# EAGLE schematic Output (EAGLE 6.4)
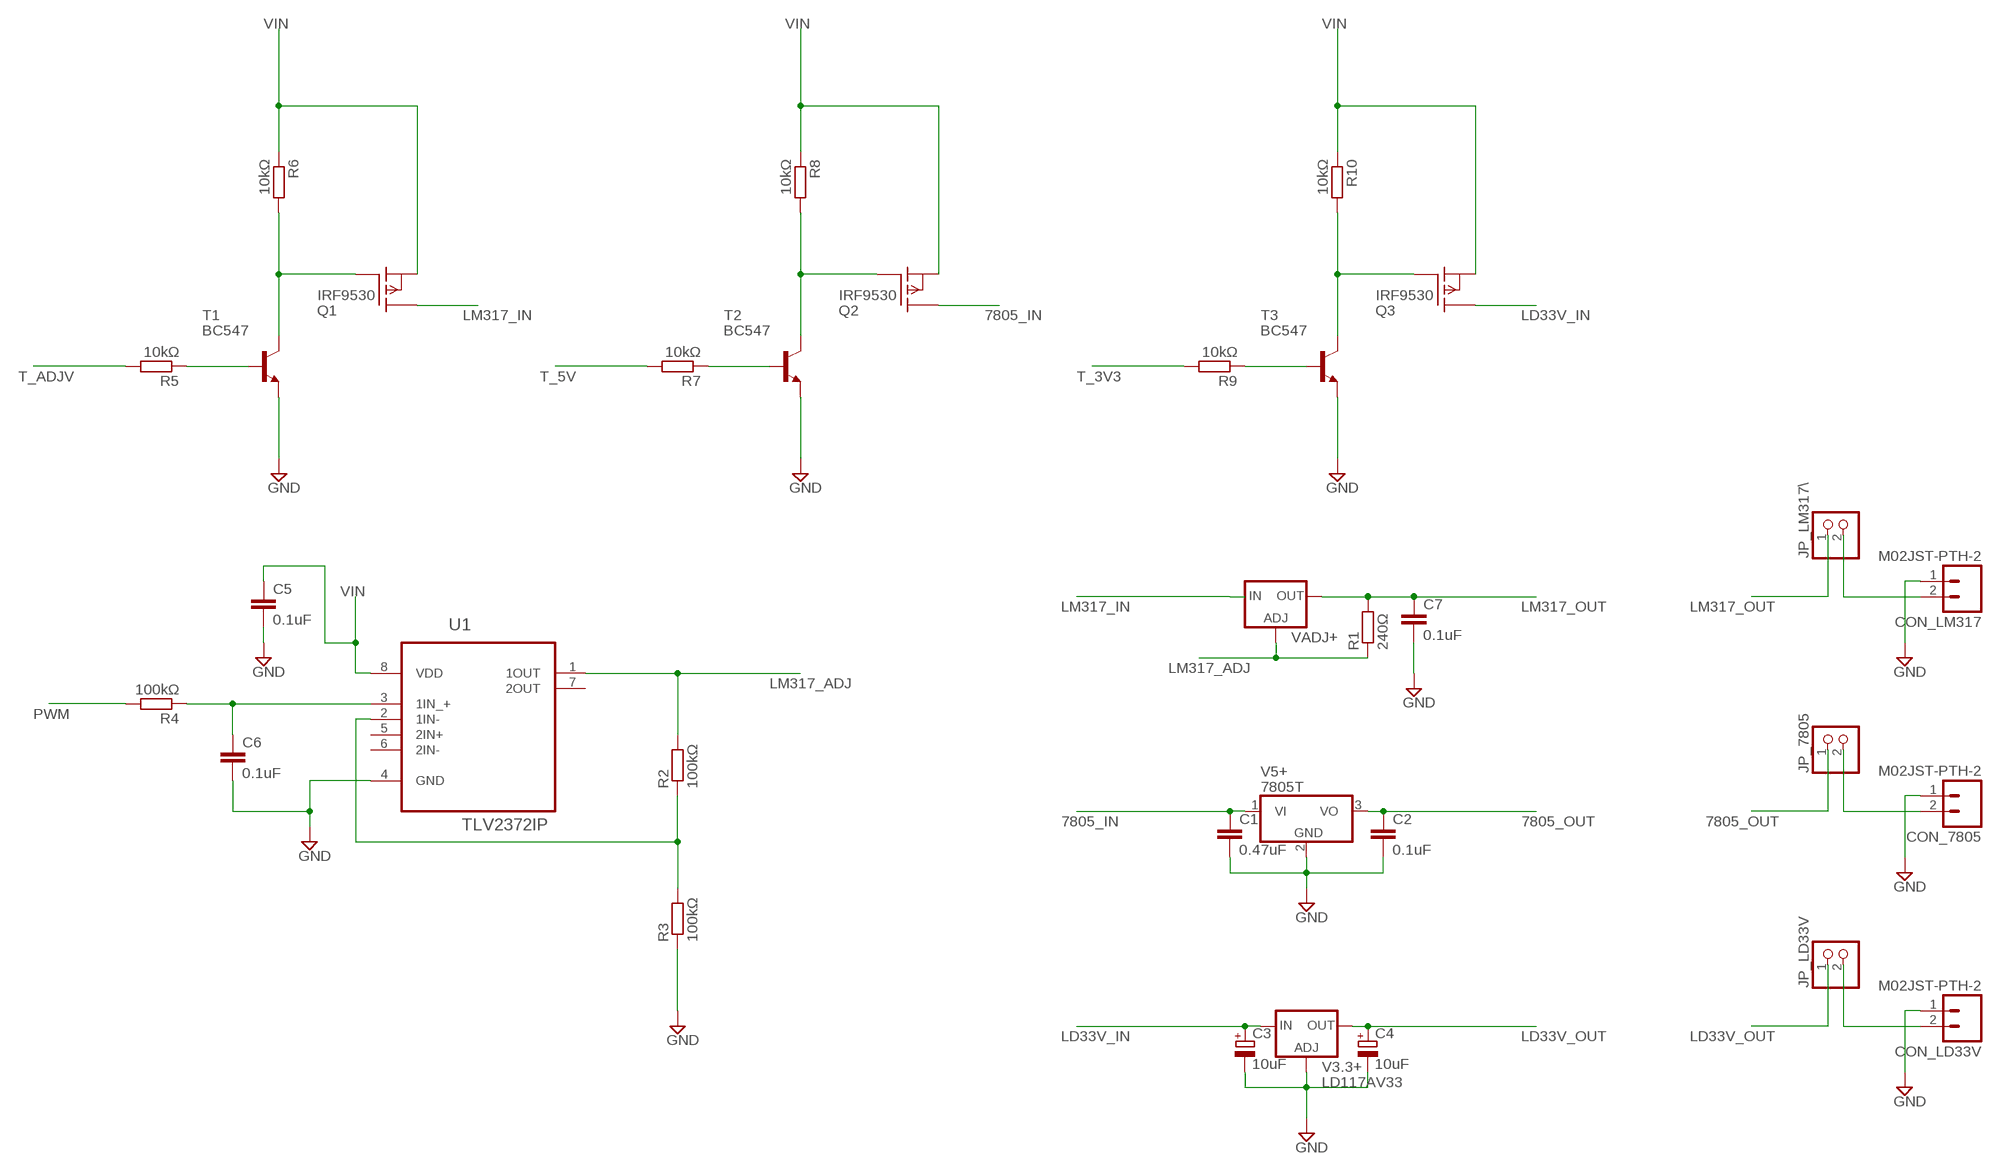
[diagram p0: schematic, sheet 1]

## Parts
C1  0.47uF  C-EU025-025X050  [C025-025X050]
C2  0.1uF  C-EU025-025X050  [C025-025X050]
C3  10uF  CPOL-EUE2.5-6  [E2,5-6]
C4  10uF  CPOL-EUE2.5-6  [E2,5-6]
C5  0.1uF  C-EU025-025X050  [C025-025X050]
C6  0.1uF  C-EU025-025X050  [C025-025X050]
C7  0.1uF  C-EU025-025X050  [C025-025X050]
CON_7805  M02JST-PTH-2  [JST-2-PTH]
CON_LD33V  M02JST-PTH-2  [JST-2-PTH]
CON_LM317  M02JST-PTH-2  [JST-2-PTH]
JP_7805  PINHD-1X2  [1X02]
JP_LD33V  PINHD-1X2  [1X02]
JP_LM317\  PINHD-1X2  [1X02]
Q1  IRF9530  [TO220]
Q2  IRF9530  [TO220]
Q3  IRF9530  [TO220]
R1  240Ω  R-EU_0207/10  [0207/10]
R2  100kΩ  R-EU_0207/10  [0207/10]
R3  100kΩ  R-EU_0207/10  [0207/10]
R4  100kΩ  R-EU_0207/10  [0207/10]
R5  10kΩ  R-EU_0207/10  [0207/10]
R6  10kΩ  R-EU_0207/10  [0207/10]
R7  10kΩ  R-EU_0207/10  [0207/10]
R8  10kΩ  R-EU_0207/10  [0207/10]
R9  10kΩ  R-EU_0207/10  [0207/10]
R10  10kΩ  R-EU_0207/10  [0207/10]
T1  BC547  [TO92]
T2  BC547  [TO92]
T3  BC547  [TO92]
U1  TLV2372IP  [DIP254P762X508-8]
V3.3+  LD117AV33  [TO220L1]
V5+  7805T  [TO220H]
VADJ+  LM317TL  [317TL]

## Nets
7805_IN: C1.1 Q2.2(D) V5+.1(VI)
7805_OUT: C2.1 JP_7805.1 V5+.3(VO)
GND: C1.2 C2.2 C3.- C4.- C5.2 C6.2 C7.2 CON_7805.1 CON_LD33V.1 CON_LM317.1 R3.1 T1.1(E) T2.1(E) T3.1(E) U1.4(GND) V3.3+.1(ADJ) V5+.2(GND)
LD33V_IN: C3.+ Q3.2(D) V3.3+.3(IN)
LD33V_OUT: C4.+ JP_LD33V.1 V3.3+.2(OUT)
LM317_ADJ: R1.1 R2.2 U1.1(1OUT) VADJ+.1(ADJ)
LM317_IN: Q1.2(D) VADJ+.3(IN)
LM317_OUT: C7.1 JP_LM317\.1 R1.2 VADJ+.2(OUT)
N$3: R2.1 R3.2 U1.2(1IN-)
N$4: R5.1 T1.2(B)
N$5: C6.1 R4.1 U1.3(1IN_+)
N$6: Q1.1(G) R6.2 T1.3(C)
N$7: CON_LM317.2 JP_LM317\.2
N$8: R7.1 T2.2(B)
N$9: Q2.1(G) R8.2 T2.3(C)
N$11: R9.1 T3.2(B)
N$12: Q3.1(G) R10.2 T3.3(C)
N$13: CON_7805.2 JP_7805.2
N$14: CON_LD33V.2 JP_LD33V.2
PWM: R4.2
T_3V3: R9.2
T_5V: R7.2
T_ADJV: R5.2
VIN: C5.1 Q1.3(S) Q2.3(S) Q3.3(S) R6.1 R8.1 R10.1 U1.8(VDD)
Unconnected: U1.5(2IN+) U1.6(2IN-) U1.7(2OUT)

## Library data of the parts
C1 C2 C5-C7 = rcl:C-EU: CAPACITOR, European symbol
C3 C4 = rcl:CPOL-EU: POLARIZED CAPACITOR, European symbol
CON_7805 CON_LD33V CON_LM317 = SparkFun-Connectors:M02: Standard 2-pin 0.1" header. Use with - straight break away headers ( PRT-00116) - right angle break away headers (PRT-00553) - swiss pins (PRT-00743) - machine pins (PRT-00117) - female headers (PRT-00115) Molex polarized connector foot print use with: PRT-08233 with associated crimp pins and housings. 2.54_SCREWTERM for use with PRT-10571. 3.5mm Screw Terminal footprints for PRT-08084 5mm Screw Terminal footprints for use with PRT-08433
JP_7805 JP_LD33V JP_LM317\ = pinhead:PINHD-1X2: PIN HEADER
Q1-Q3 = transistor-fet:IRF9530: P-Channel Enhancement MOSFET (HEXFET); -100V; -12A; 0,3Ohm
R1-R10 = resistor:R-EU_: RESISTOR, European symbol
T1-T3 = transistor:BC547: NPN TRANSISTOR
U1 = Texas Instruments_By_element14_Batch_1:TLV2372IP: OPERATIONAL AMPLIFIER; MPN: TLV2372IP; OC_FARNELL: 8455031; OC_NEWARK: 76C7976; PACKAGE: PDIP; SUPPLIER: Texas Instruments
V3.3+ = v-reg:LD117A?*: Low drop fixed and adjustable positive voltage regulators 1 A Source: http://www.st.com/stonline/products/literature/ds/7194/ld1117axx.pdf
V5+ = linear:78*: Positive VOLTAGE REGULATOR Source: http://cache.national.com/ds/LM/LM78L05.pdf http://www.fairchildsemi.com/ds/LM/LM7805.pdf
VADJ+ = v-reg:LM317TL: VOLTAGE REGULATOR